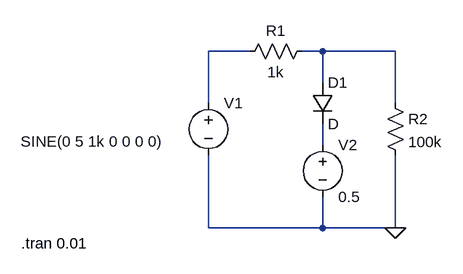
[diagram p0: schematic Clipper.asc]
Clipper.asc, the LTspice schematic file:
Version 4.1
SHEET 1 880 680
WIRE 128 80 64 80
WIRE 240 80 208 80
WIRE 352 80 240 80
WIRE 240 128 240 80
WIRE 64 160 64 80
WIRE 352 160 352 80
WIRE 240 224 240 192
WIRE 64 352 64 240
WIRE 240 352 240 304
WIRE 240 352 64 352
WIRE 352 352 352 240
WIRE 352 352 240 352
FLAG 352 352 0
SYMBOL voltage 64 144 R0
WINDOW 3 -289 75 Left 2
WINDOW 123 0 0 Left 0
WINDOW 39 0 0 Left 0
SYMATTR InstName V1
SYMATTR Value SINE(0 5 1k 0 0 0 0)
SYMBOL res 224 64 R90
WINDOW 0 0 56 VBottom 2
WINDOW 3 32 56 VTop 2
SYMATTR InstName R1
SYMATTR Value 1k
SYMBOL diode 224 128 R0
SYMATTR InstName D1
SYMBOL voltage 240 208 R0
WINDOW 123 0 0 Left 0
WINDOW 39 0 0 Left 0
SYMATTR InstName V2
SYMATTR Value 0.5
SYMBOL res 336 144 R0
SYMATTR InstName R2
SYMATTR Value 100k
TEXT -224 376 Left 2 !.tran 0.01

The netlist it stands for:
* Clipper.asc
V1 N001 0 SINE(0 5 1k 0 0 0 0)
R1 N002 N001 1k
D1 N002 N003 D
V2 N003 0 0.5
R2 N002 0 100k
.model D D
.lib standard.dio
.tran 0.01
.backanno
.end